# EAGLE design scales_old_new (EAGLE 7.3.0)
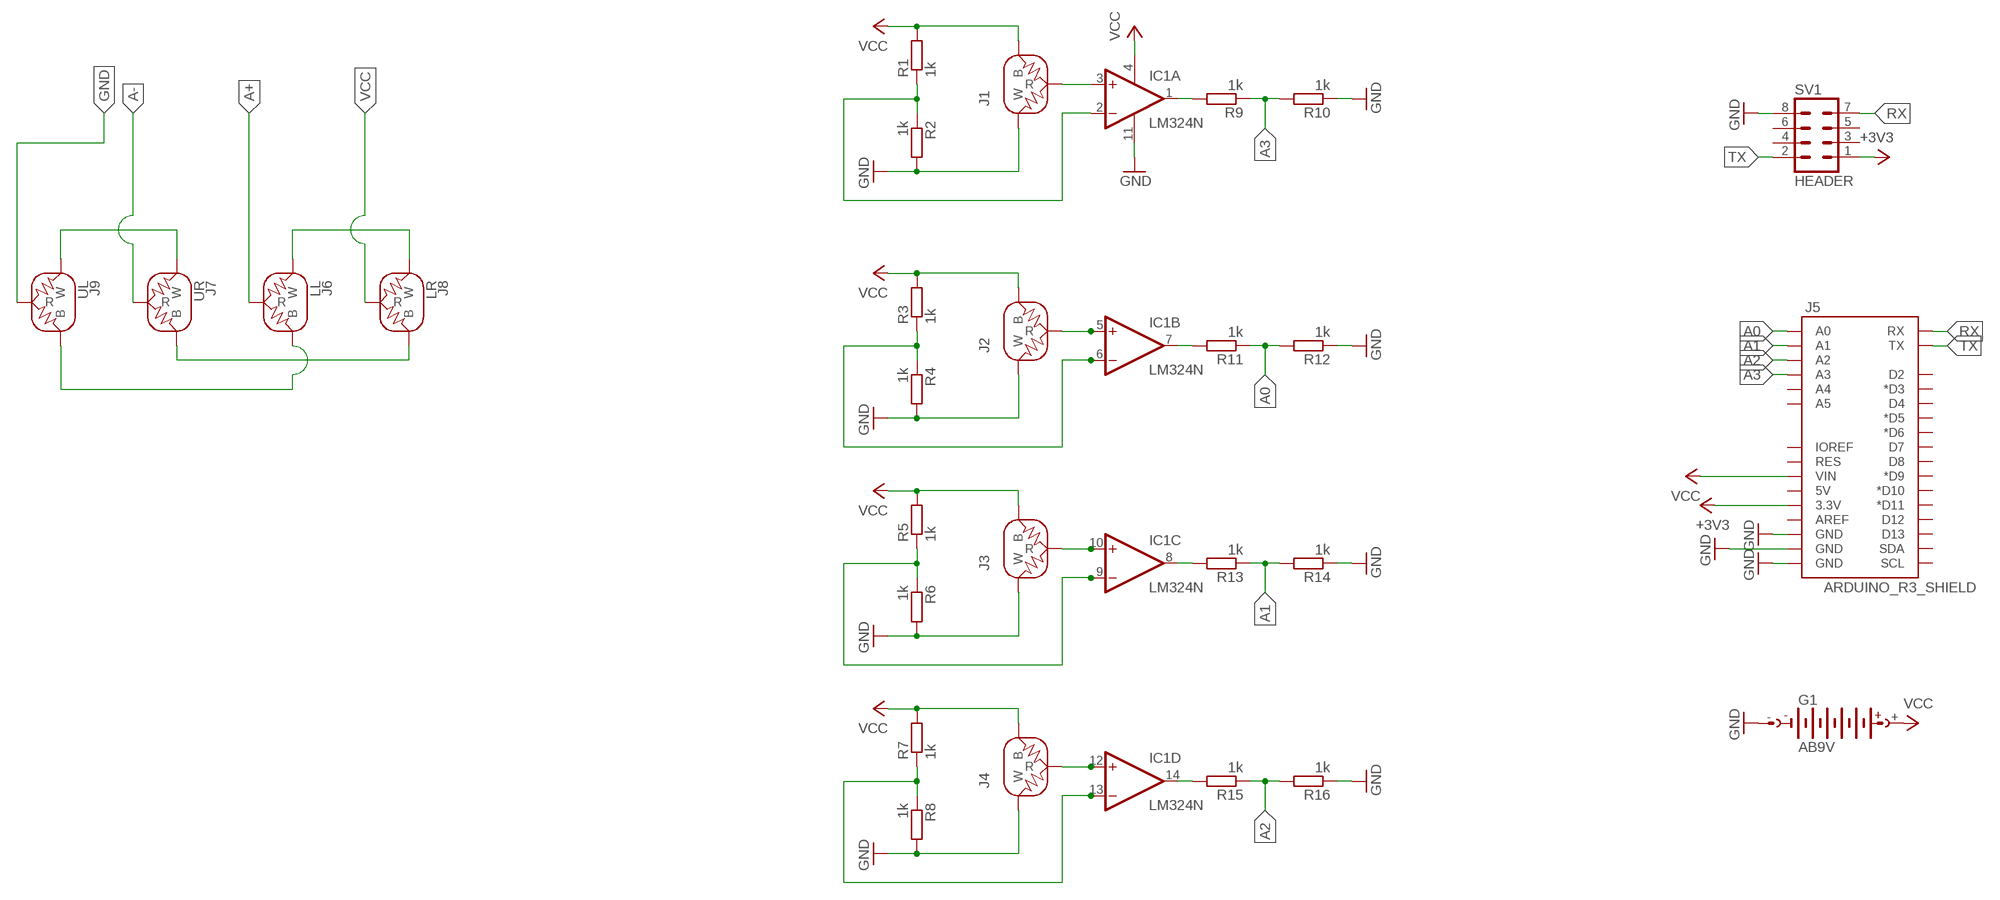
[diagram p0: schematic, sheet 1]

## Parts
G1  AB9V  [AB9V]
IC1  LM324N  [DIL14]
J1  LOAD_CELL1X03-PTH  [1X03]
J2  LOAD_CELL1X03-PTH  [1X03]
J3  LOAD_CELL1X03-PTH  [1X03]
J4  LOAD_CELL1X03-PTH  [1X03]
J5  ARDUINO_R3_SHIELD  [UNO_R3_SHIELD]
J6  LL  LOAD_CELL1X03-PTH  [1X03]
J7  UR  LOAD_CELL1X03-PTH  [1X03]
J8  LR  LOAD_CELL1X03-PTH  [1X03]
J9  UL  LOAD_CELL1X03-PTH  [1X03]
R1  1k  R-EU_0204/5  [0204/5]
R2  1k  R-EU_0204/5  [0204/5]
R3  1k  R-EU_0204/5  [0204/5]
R4  1k  R-EU_0204/5  [0204/5]
R5  1k  R-EU_0204/5  [0204/5]
R6  1k  R-EU_0204/5  [0204/5]
R7  1k  R-EU_0204/5  [0204/5]
R8  1k  R-EU_0204/5  [0204/5]
R9  1k  R-EU_0204/5  [0204/5]
R10  1k  R-EU_0204/5  [0204/5]
R11  1k  R-EU_0204/5  [0204/5]
R12  1k  R-EU_0204/5  [0204/5]
R13  1k  R-EU_0204/5  [0204/5]
R14  1k  R-EU_0204/5  [0204/5]
R15  1k  R-EU_0204/5  [0204/5]
R16  1k  R-EU_0204/5  [0204/5]
SV1  HEADER  MA04-2  [MA04-2]

## Nets
+3V3: J5.3.3V SV1.1
A0: J5.A0 R11.1 R12.2
A1: J5.A1 R13.1 R14.2
A2: J5.A2 R15.1 R16.2
A3: J5.A3 R9.1 R10.2
A+: J6.3(R)
A-: J7.3(R)
GND: G1.- IC1.11(P:V-) J1.2(W) J2.2(W) J3.2(W) J4.2(W) J5.GND@0(GND) J5.GND@1(GND) J5.GND@2(GND) J9.3(R) R2.2 R4.2 R6.2 R8.2 R10.1 R12.1 R14.1 R16.1 SV1.8
N$1: IC1.5(B:+IN) J2.3(R)
N$2: IC1.6(B:-IN) R3.1 R4.1
N$3: IC1.10(C:+IN) J3.3(R)
N$4: IC1.9(C:-IN) R5.1 R6.1
N$5: IC1.2(A:-IN) R1.1 R2.1
N$6: IC1.1(A:OUT) R9.2
N$7: IC1.12(D:+IN) J4.3(R)
N$8: IC1.13(D:-IN) R7.1 R8.1
N$9: IC1.7(B:OUT) R11.2
N$10: IC1.3(A:+IN) J1.3(R)
N$11: IC1.8(C:OUT) R13.2
N$12: IC1.14(D:OUT) R15.2
N$13: J6.1(B) J9.1(B)
N$14: J7.1(B) J8.1(B)
N$15: J7.2(W) J9.2(W)
N$16: J6.2(W) J8.2(W)
RX: J5.RX SV1.7
TX: J5.TX SV1.2
VCC: G1.+ IC1.4(P:V+) J1.1(B) J2.1(B) J3.1(B) J4.1(B) J5.VIN J8.3(R) R1.2 R3.2 R5.2 R7.2
Unconnected: J5.5V J5.A4 J5.A5 J5.AREF J5.D2 J5.D3(*D3) J5.D4 J5.D5(*D5) J5.D6(*D6) J5.D7 J5.D8 J5.D9(*D9) J5.D10(*D10) J5.D11(*D11) J5.D12 J5.D13 J5.IOREF J5.RES J5.SCL J5.SDA SV1.3 SV1.4 SV1.5 SV1.6

## Library data of the parts
G1 = battery:AB9V: 9-V BATTERY CLIP; MF: MULTICOMP; MPN: 440005P; OC_FARNELL: 1183123
IC1 = linear:LM324: OP AMP; MF: STMICROELECTRONICS; MPN: LM324AN; OC_FARNELL: 1467654
J1-J4 J6-J9 = SparkFun-Sensors:LOAD_CELL: Half-wheatstone bridge Load Cell; OC_FARNELL: unknown
J5 = SparkFun-Boards:ARDUINO_R3_SHIELD: Shield form compatible with the Arduino Uno R3.; OC_FARNELL: unknown
R1-R16 = resistor:R-EU_: RESISTOR, European symbol; MF: PANASONIC ELECTRONIC COMPONENTS; MPN: ERG1SJ102; OC_FARNELL: 2324488
SV1 = con-lstb:MA04-2: PIN HEADER; MF: GLOBAL CONNECTOR TECHNOLOGY; MPN: BD060-08-A-N-0230-L-G; OC_FARNELL: 1798806; OC_NEWARK: unknown

## Net classes
0 default: width 0.305 mm, drill 0.508 mm, clearance 0.254 mm

## Board
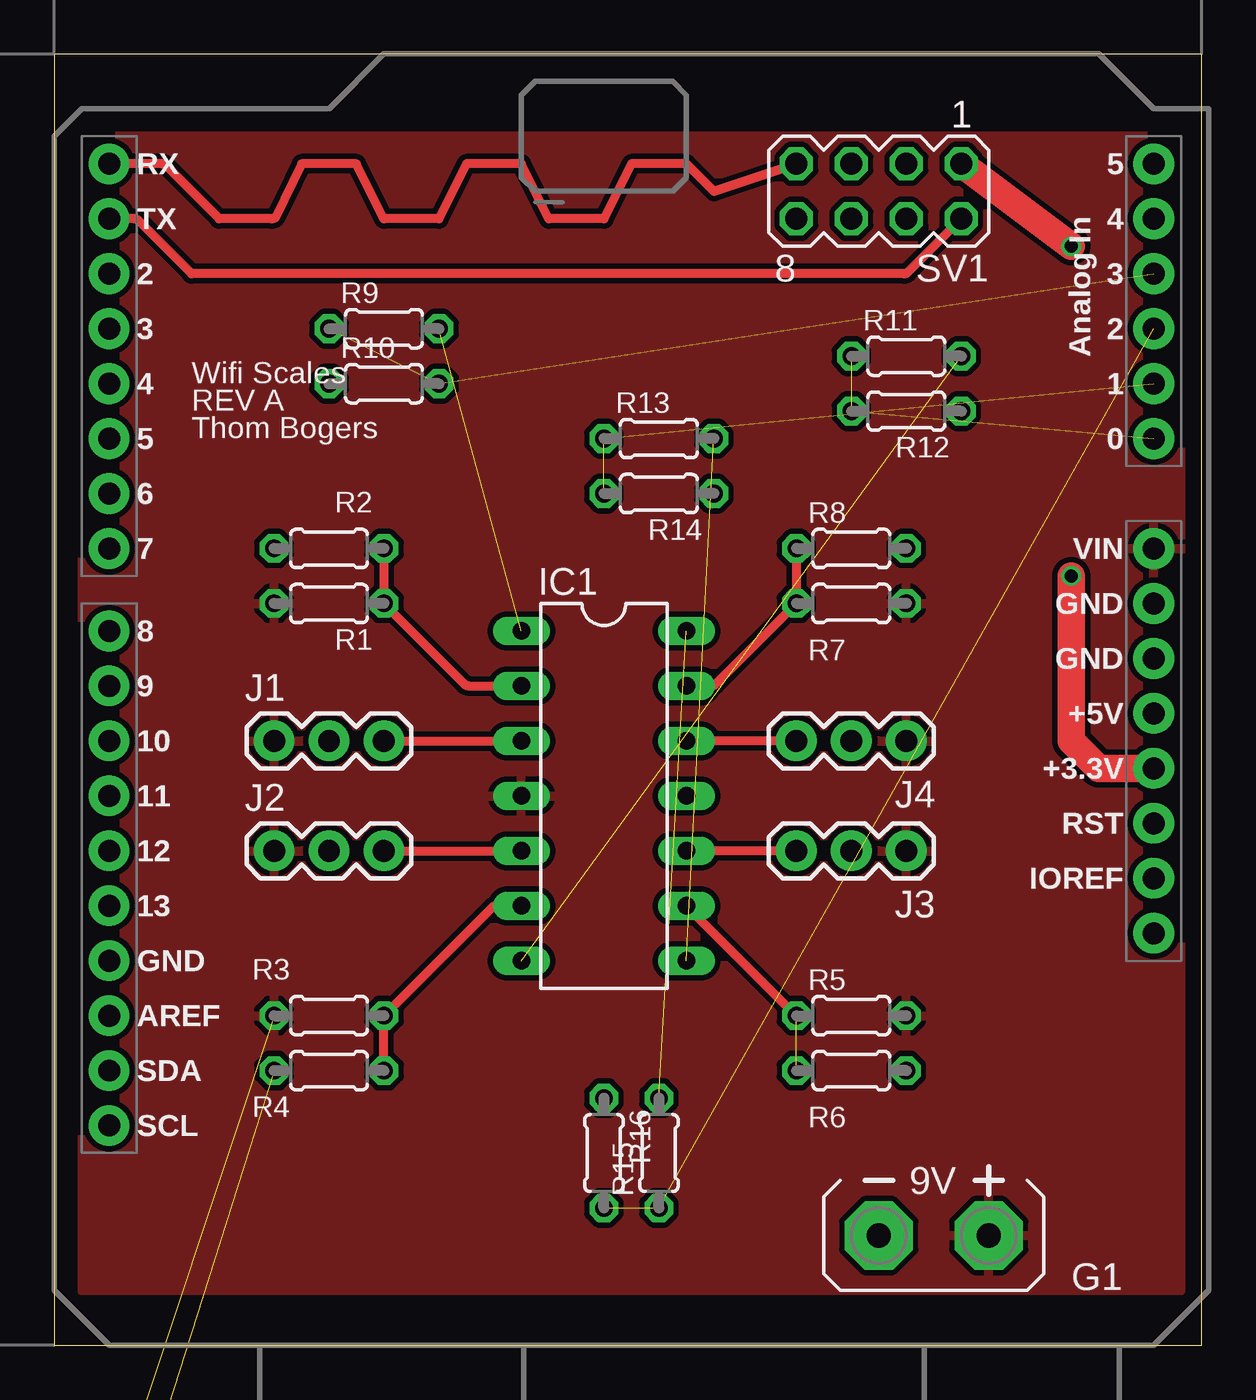
[diagram p1: board, top side]
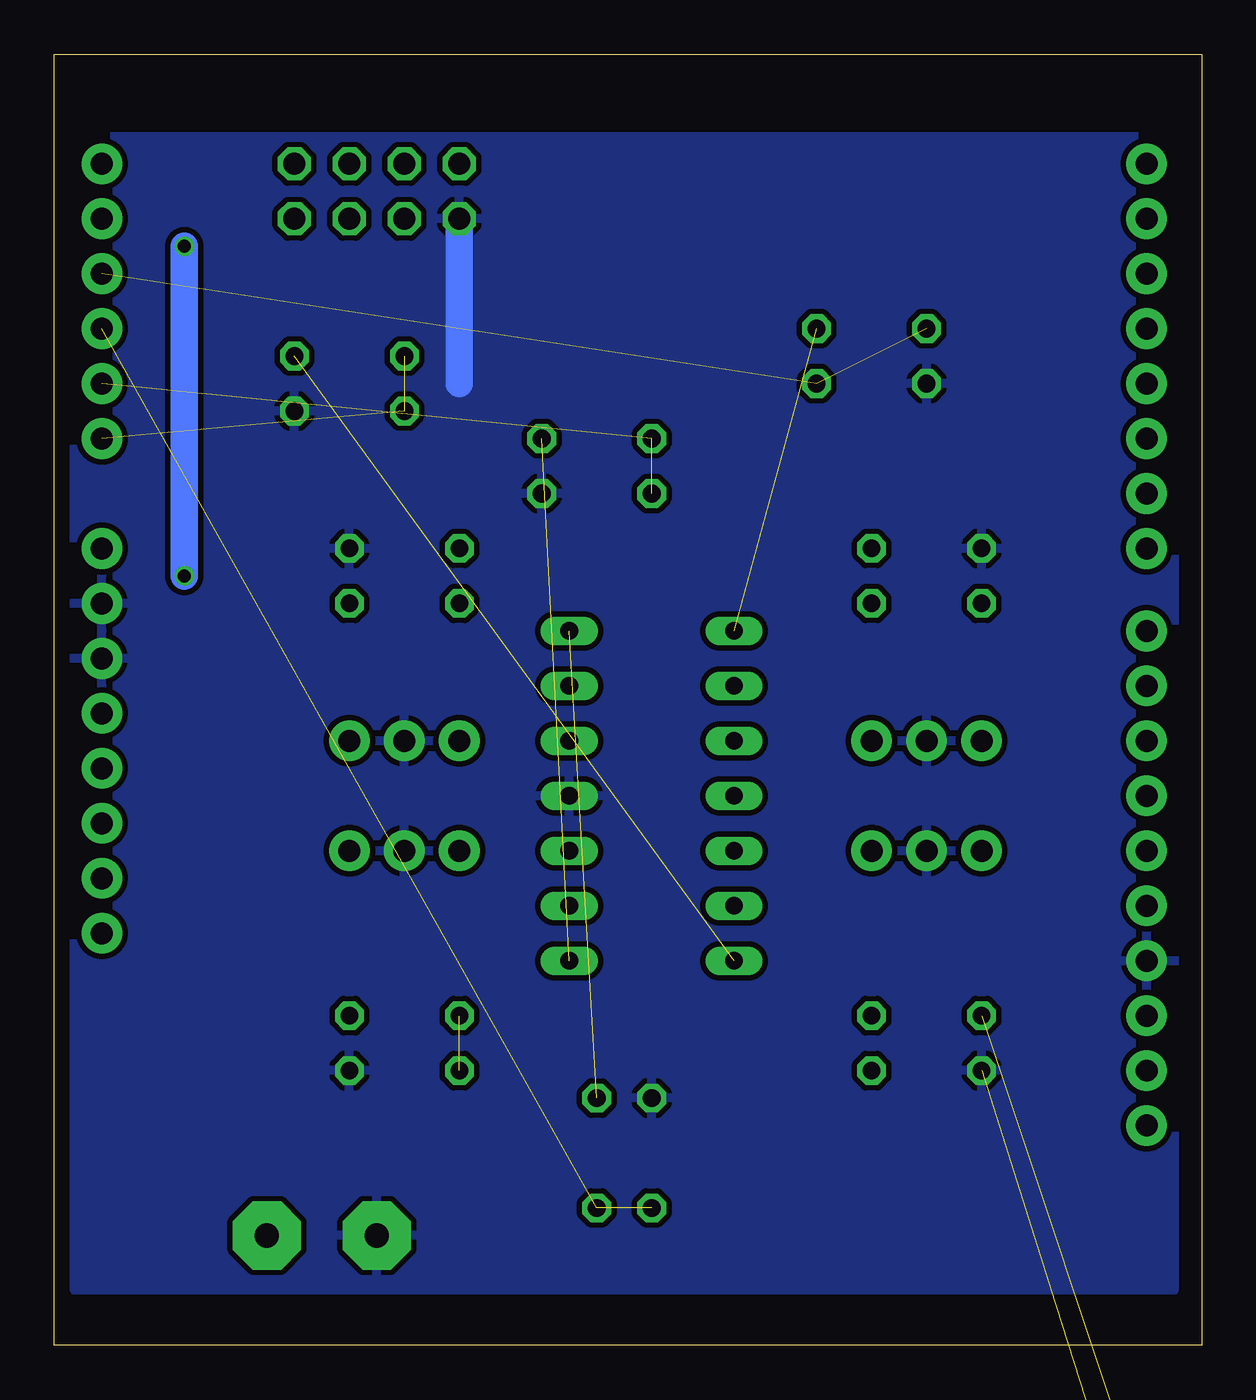
[diagram p2: board, bottom side, seen from below]

Size 53.01 x 59.68 mm. Coordinates in mm from the lower left corner, seen from the top.
Outline: 0,0 53.01,0 53.01,59.68 0,59.68 0,0
Copper layers (1*16): Top 0.035mm / dielectric 1.5mm / Bottom 0.035mm
Design rules "Elecrow_2-layer_eagle_rule": minimum track width 6mil, minimum drill 12mil, track to track 6mil, track to pad 6mil, pad to pad 6mil, via to via 6mil, smd to smd 0mil, copper to edge 10mil, drill to drill 10mil, minimum pad ring 10mil, minimum via ring 6mil, stop-mask expansion 2mil, vias tented up to drill 100mil, thermal gap 10mil

### Footprints (pad centres in the part's own frame; a part is rotated, then mirrored left to right if it is on the bottom)
AB9V = drill 1.118 pad 3.15 octagon: + 0,2.54; - 0,-2.54
DIL14 = drill 0.813 long: 1 -7.62,-3.81; 2 -5.08,-3.81; 3 -2.54,-3.81; 4 0,-3.81; 5 2.54,-3.81; 6 5.08,-3.81; 7 7.62,-3.81; 8 7.62,3.81; 9 5.08,3.81; 10 2.54,3.81; 11 0,3.81; 12 -2.54,3.81; 13 -5.08,3.81; 14 -7.62,3.81
1X03 = drill 1.016 pad 1.88: 1 0,0; 2 2.54,0; 3 5.08,0
UNO_R3_SHIELD = drill 1.016 pad 1.88: 3.3V 50.8,26.67; 5V 50.8,29.21; A0 50.8,41.91; A1 50.8,44.45; A2 50.8,46.99; A3 50.8,49.53; A4 50.8,52.07; A5 50.8,54.61; AREF 2.54,15.24; D2 2.54,49.53; D3 2.54,46.99; D4 2.54,44.45; D5 2.54,41.91; D6 2.54,39.37; D7 2.54,36.83; D8 2.54,33.02; D9 2.54,30.48; D10 2.54,27.94; D11 2.54,25.4; D12 2.54,22.86; D13 2.54,20.32; GND@0 50.8,31.75; GND@1 50.8,34.29; GND@2 2.54,17.78; IOREF 50.8,21.59; NC 50.8,19.05; RES 50.8,24.13; RX 2.54,54.61; SCL 2.54,10.16; SDA 2.54,12.7; TX 2.54,52.07; VIN 50.8,36.83
0204/5 = drill 0.813 octagon: 1 -2.54,0; 2 2.54,0
MA04-2 = drill 1.016 octagon: 1 -3.81,-1.27; 2 -3.81,1.27; 3 -1.27,-1.27; 4 -1.27,1.27; 5 1.27,-1.27; 6 1.27,1.27; 7 3.81,-1.27; 8 3.81,1.27

### Placement (x,y rotation side)
G1  40.64,5.08 270 top
IC1  25.4,25.4 270 top
J1  10.16,27.94 0 top
J2  10.16,22.86 0 top
J3  39.37,22.86 180 top
J4  39.37,27.94 180 top
J5  0,0 0 top
J6  -10.16,-20.32 0 top  (outside the outline)
J7  -10.16,-25.4 0 top  (outside the outline)
J8  -10.16,-30.48 0 top  (outside the outline)
J9  -10.16,-35.56 0 top  (outside the outline)
R1  12.7,34.29 180 top
R2  12.7,36.83 180 top
R3  12.7,15.24 180 top
R4  12.7,12.7 180 top
R5  36.83,15.24 0 top
R6  36.83,12.7 0 top
R7  36.83,34.29 0 top
R8  36.83,36.83 0 top
R9  15.24,46.99 0 top
R10  15.24,44.45 0 top
R11  39.37,45.72 0 top
R12  39.37,43.18 180 top
R13  27.94,41.91 0 top
R14  27.94,39.37 180 top
R15  27.94,8.89 90 top
R16  25.4,8.89 270 top
SV1  38.1,53.34 180 top

### Tracks (layer width: path | path; a pad name or v marks a point on that pad's centre or on a via)
+3V3  (via drill 0.6)
  Top 1.27: J5.3.3V 48.26,26.67 46.99,27.94 v46.99,35.56 | v46.99,50.8 SV1.1
  Bottom 1.27: v46.99,35.56 v46.99,50.8
A0  (2 unrouted)
A1  (2 unrouted)
A2  (2 unrouted)
A3  (2 unrouted)
GND  (1 unrouted)
  Bottom 1.27: SV1.8 34.29,44.45
  pour Bottom: 1.27,55.88 1.27,2.54 52.07,2.54 52.07,55.88
N$1
  Top 0.406: J2.3 IC1.5
N$2
  Top 0.406: IC1.6 20.43,20.32 arc45 20.25,20.25 R3.1 R4.1
N$3
  Top 0.406: J3.3 IC1.10
N$4  (1 unrouted)
  Top 0.406: R5.1 IC1.9
N$5
  Top 0.406: IC1.2 19.16,30.48 arc-45 18.98,30.55 R1.1 R2.1
N$6  (1 unrouted)
N$7
  Top 0.406: J4.3 IC1.12
N$8
  Top 0.406: IC1.13 30.38,30.48 arc45 30.55,30.55 R7.1 R8.1
N$9  (1 unrouted)
N$10
  Top 0.406: J1.3 IC1.3
N$11  (1 unrouted)
N$12  (1 unrouted)
N$13  (1 unrouted)
N$14  (1 unrouted)
N$15  (1 unrouted)
N$16  (1 unrouted)
RX
  Top 0.406: J5.RX 4.97,54.61 arc-45 5.15,54.54 7.62,52.07 10.05,52.07 arc45 10.23,52.14 11.43,54.61 13.97,54.61 15.24,52.07 17.78,52.07 19.05,54.61 21.59,54.61 22.86,52.07 25.4,52.07 26.67,54.61 29.21,54.61 30.48,53.34 SV1.7
TX
  Top 0.406: SV1.2 39.44,49.6 arc-45 39.27,49.53 6.35,49.53 3.88,52 arc45 3.71,52.07 J5.TX
VCC  (1 unrouted)
  pour Top: 1.27,55.88 1.27,2.54 52.07,2.54 52.07,55.88

### Text on the board
tPlace: Wifi Scales | REV A | Thom Bogers